# Altium schematic sheet new.SchDoc
size A2
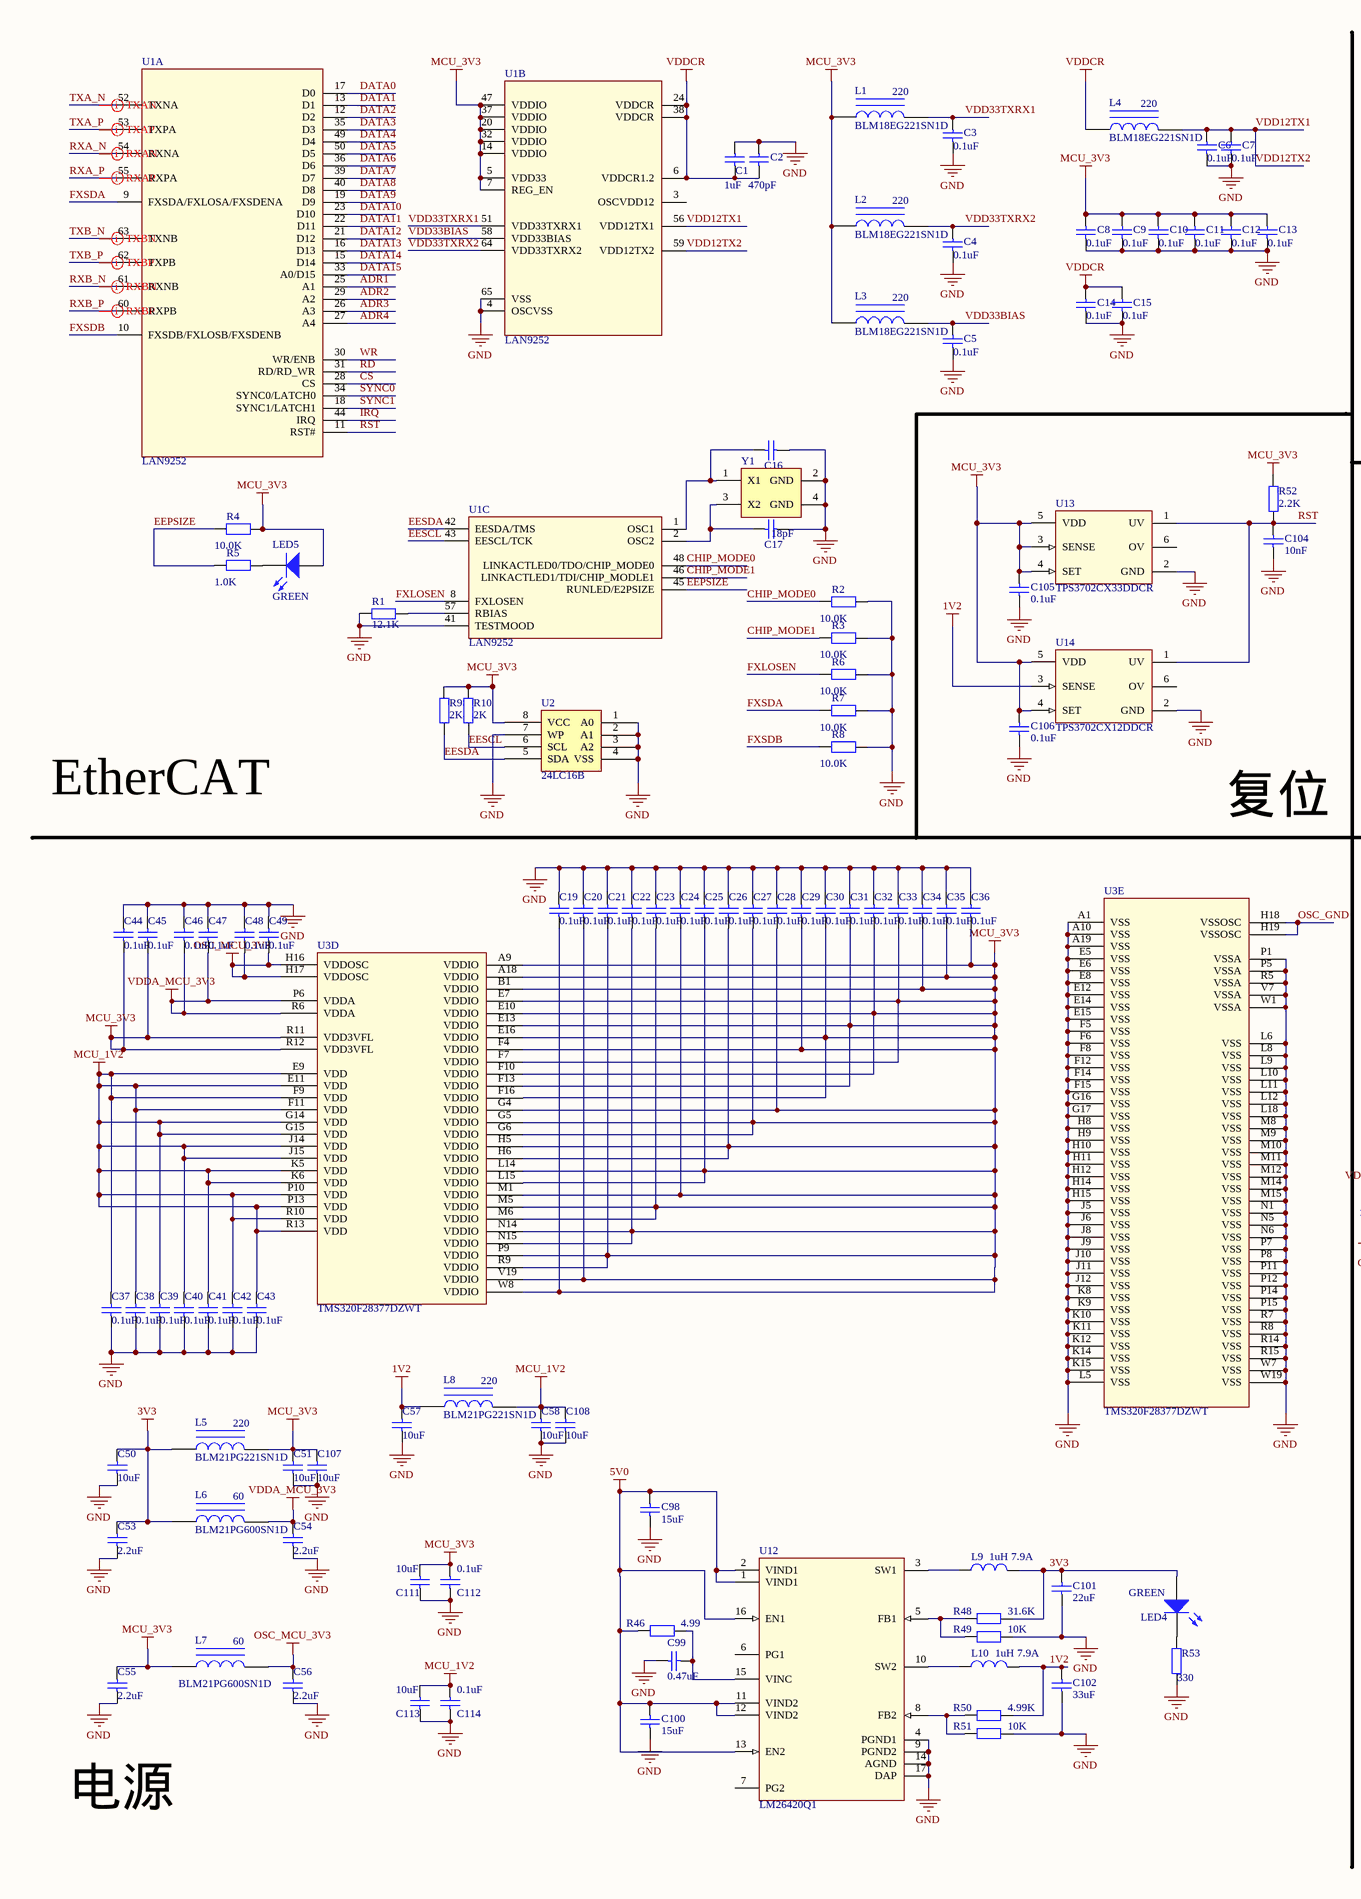
[diagram p0: new.SchDoc, left]
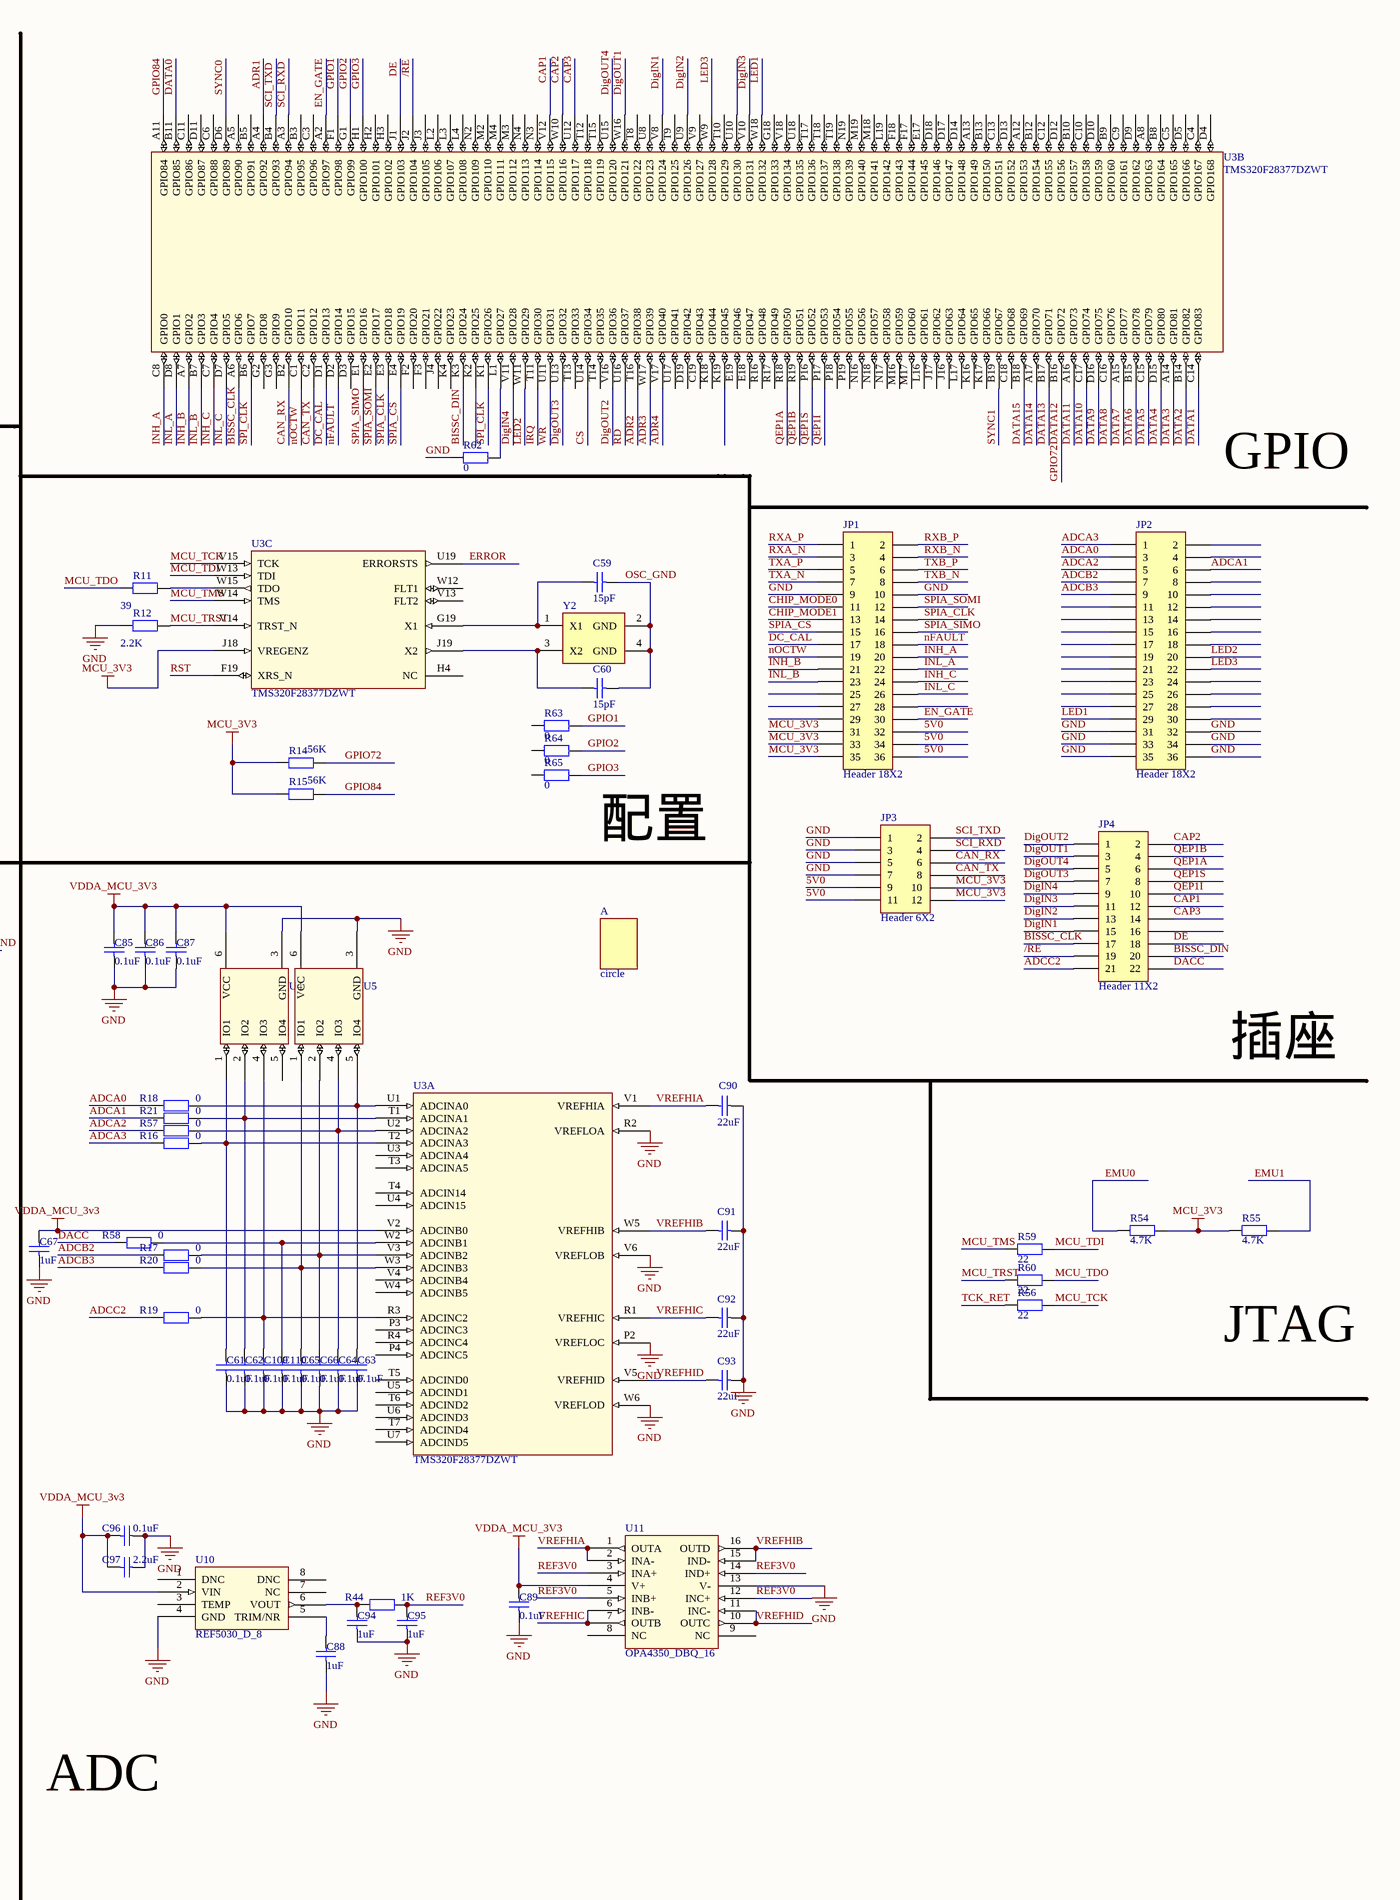
[diagram p1: new.SchDoc, right]

## Parts
A  circle  [Circle]
C1  value 1uF  [CC1608-0603]  (hidden comment: 0603B105J6R3NT)
C2  value 470pF  [CC1005-0402]  (hidden comment: 0402B471J6R3NT)
C3  value 0.1uF  [CC1005-0402]  (hidden comment: 0402B104J6R3NT)
C4  value 0.1uF  [CC1005-0402]  (hidden comment: 0402B104J6R3NT)
C5  value 0.1uF  [CC1005-0402]  (hidden comment: 0402B104J6R3NT)
C6  value 0.1uF  [CC1005-0402]  (hidden comment: 0402B104J6R3NT)
C7  value 0.1uF  [CC1005-0402]  (hidden comment: 0402B104J6R3NT)
C8  value 0.1uF  [CC1005-0402]  (hidden comment: 0402B104J6R3NT)
C9  value 0.1uF  [CC1005-0402]  (hidden comment: 0402B104J6R3NT)
C10  value 0.1uF  [CC1005-0402]  (hidden comment: 0402B104J6R3NT)
C11  value 0.1uF  [CC1005-0402]  (hidden comment: 0402B104J6R3NT)
C12  value 0.1uF  [CC1005-0402]  (hidden comment: 0402B104J6R3NT)
C13  value 0.1uF  [CC1005-0402]  (hidden comment: 0402B104J6R3NT)
C14  value 0.1uF  [CC1005-0402]  (hidden comment: 0402B104J6R3NT)
C15  value 0.1uF  [CC1005-0402]  (hidden comment: 0402B104J6R3NT)
C16  value 18pF  [CC1005-0402]  (hidden comment: 0402B180J6R3NT)
C17  Vaule: 18pF  [CC1005-0402]  (hidden comment: 0402B180J6R3NT)
C19  value 0.1uF  [CC1005-0402]  (hidden comment: 0402B104J6R3NT)
C20  value 0.1uF  [CC1005-0402]  (hidden comment: 0402B104J6R3NT)
C21  value 0.1uF  [CC1005-0402]  (hidden comment: 0402B104J6R3NT)
C22  value 0.1uF  [CC1005-0402]  (hidden comment: 0402B104J6R3NT)
C23  value 0.1uF  [CC1005-0402]  (hidden comment: 0402B104J6R3NT)
C24  value 0.1uF  [CC1005-0402]  (hidden comment: 0402B104J6R3NT)
C25  value 0.1uF  [CC1005-0402]  (hidden comment: 0402B104J6R3NT)
C26  value 0.1uF  [CC1005-0402]  (hidden comment: 0402B104J6R3NT)
C27  value 0.1uF  [CC1005-0402]  (hidden comment: 0402B104J6R3NT)
C28  value 0.1uF  [CC1005-0402]  (hidden comment: 0402B104J6R3NT)
C29  value 0.1uF  [CC1005-0402]  (hidden comment: 0402B104J6R3NT)
C30  value 0.1uF  [CC1005-0402]  (hidden comment: 0402B104J6R3NT)
C31  value 0.1uF  [CC1005-0402]  (hidden comment: 0402B104J6R3NT)
C32  value 0.1uF  [CC1005-0402]  (hidden comment: 0402B104J6R3NT)
C33  value 0.1uF  [CC1005-0402]  (hidden comment: 0402B104J6R3NT)
C34  value 0.1uF  [CC1005-0402]  (hidden comment: 0402B104J6R3NT)
C35  value 0.1uF  [CC1005-0402]  (hidden comment: 0402B104J6R3NT)
C36  value 0.1uF  [CC1005-0402]  (hidden comment: 0402B104J6R3NT)
C37  value 0.1uF  [CC1005-0402]  (hidden comment: 0402B104J6R3NT)
C38  value 0.1uF  [CC1005-0402]  (hidden comment: 0402B104J6R3NT)
C39  value 0.1uF  [CC1005-0402]  (hidden comment: 0402B104J6R3NT)
C40  value 0.1uF  [CC1005-0402]  (hidden comment: 0402B104J6R3NT)
C41  value 0.1uF  [CC1005-0402]  (hidden comment: 0402B104J6R3NT)
C42  value 0.1uF  [CC1005-0402]  (hidden comment: 0402B104J6R3NT)
C43  value 0.1uF  [CC1005-0402]  (hidden comment: 0402B104J6R3NT)
C44  value 0.1uF  [CC1005-0402]  (hidden comment: 0402B104J6R3NT)
C45  value 0.1uF  [CC1005-0402]  (hidden comment: 0402B104J6R3NT)
C46  value 0.1uF  [CC1005-0402]  (hidden comment: 0402B104J6R3NT)
C47  value 0.1uF  [CC1005-0402]  (hidden comment: 0402B104J6R3NT)
C48  value 0.1uF  [CC1005-0402]  (hidden comment: 0402B104J6R3NT)
C49  value 0.1uF  [CC1005-0402]  (hidden comment: 0402B104J6R3NT)
C50  value 10uF  [CC1608-0603]  (hidden comment: 0603B106J6R3NT)
C51  value 10uF  [CC1608-0603]  (hidden comment: 0603B106J6R3NT)
C53  value 2.2uF  [CC1608-0603]  (hidden comment: 0603B225J6R3NT)
C54  value 2.2uF  [CC1608-0603]  (hidden comment: 0603B225J6R3NT)
C55  value 2.2uF  [CC1608-0603]  (hidden comment: 0603B225J6R3NT)
C56  value 2.2uF  [CC1608-0603]  (hidden comment: 0603B225J6R3NT)
C57  value 10uF  [CC1608-0603]  (hidden comment: 0603B106J6R3NT)
C58  value 10uF  [CC1608-0603]  (hidden comment: 0603B106J6R3NT)
C59  value 15pF  [CC1005-0402]  (hidden comment: 0402B150J6R3NT)
C60  value 15pF  [CC1005-0402]  (hidden comment: 0402B150J6R3NT)
C61  value 0.1uF  [CC1005-0402]  (hidden comment: 0402B104J6R3NT)
C62  value 0.1uF  [CC1005-0402]  (hidden comment: 0402B104J6R3NT)
C63  value 0.1uF  [CC1005-0402]  (hidden comment: 0402B104J6R3NT)
C64  value 0.1uF  [CC1005-0402]  (hidden comment: 0402B104J6R3NT)
C65  value 0.1uF  [CC1005-0402]  (hidden comment: 0402B104J6R3NT)
C66  value 0.1uF  [CC1005-0402]  (hidden comment: 0402B104J6R3NT)
C67  value 1uF  [CC1005-0402]  (hidden comment: 0402B105J6R3NT)
C85  value 0.1uF  [CC1005-0402]  (hidden comment: 0402B104J6R3NT)
C86  value 0.1uF  [CC1005-0402]  (hidden comment: 0402B104J6R3NT)
C87  value 0.1uF  [CC1005-0402]  (hidden comment: 0402B104J6R3NT)
C88  value 1uF  [CC1608-0603]  (hidden comment: 0603B105J6R3NT)
C89  value 0.1uF  [CC1005-0402]  (hidden comment: 0402B104J6R3NT)
C90  value 22uF  [CC2012-0805]  (hidden comment: 0805B226J6R3NT)
C91  value 22uF  [CC2012-0805]  (hidden comment: 0805B226J6R3NT)
C92  value 22uF  [CC2012-0805]  (hidden comment: 0805B226J6R3NT)
C93  value 22uF  [CC2012-0805]  (hidden comment: 0805B226J6R3NT)
C94  value 1uF  [CC1608-0603]  (hidden comment: 0603B105J6R3NT)
C95  value 1uF  [CC1608-0603]  (hidden comment: 0603B105J6R3NT)
C96  value 0.1uF  [CC1005-0402]  (hidden comment: 0402B104J6R3NT)
C97  value 2.2uF  [CC1608-0603]  (hidden comment: 0603B225J6R3NT)
C98  value 15uF  [CC3216-1206]  (hidden comment: 1206B156J6R3NT)
C99  value 0.47uF  [CC2012-0805]  (hidden comment: 0805B474J6R3NT)
C100  value 15uF  [CC3216-1206]  (hidden comment: 1206B156J6R3NT)
C101  value 22uF  [CC3216-1206]  (hidden comment: 1206B226J6R3NT)
C102  value 33uF  [CC3225-1210]  (hidden comment: 1206B336J6R3NT)
C104  value 10nF  [CC1005-0402]  (hidden comment: 0402B103J6R3NT)
C105  value 0.1uF  [CC1005-0402]  (hidden comment: 0402B104J6R3NT)
C106  value 0.1uF  [CC1005-0402]  (hidden comment: 0402B104J6R3NT)
C107  value 10uF  [CC1608-0603]  (hidden comment: 0603B106J6R3NT)
C108  value 10uF  [CC1608-0603]  (hidden comment: 0603B106J6R3NT)
C109  value 0.1uF  [CC1005-0402]  (hidden comment: 0402B104J6R3NT)
C110  value 0.1uF  [CC1005-0402]  (hidden comment: 0402B104J6R3NT)
C111  value 10uF  [CC1608-0603]  (hidden comment: 0603B106J6R3NT)
C112  value 0.1uF  [CC1005-0402]  (hidden comment: 0402B104J6R3NT)
C113  value 10uF  [CC1608-0603]  (hidden comment: 0603B106J6R3NT)
C114  value 0.1uF  [CC1005-0402]  (hidden comment: 0402B104J6R3NT)
JP1  Header 18X2  [DC_1.27_36]
JP2  Header 18X2  [DC_1.27_36]
JP3  Header 6X2  [DC_1.27_12]
JP4  Header 11X2  [DC_1.27_22]
L1  BLM18EG221SN1D  value 220  [BLM0603]
L2  BLM18EG221SN1D  value 220  [BLM0603]
L3  BLM18EG221SN1D  value 220  [BLM0603]
L4  BLM18EG221SN1D  value 220  [BLM0603]
L5  BLM21PG221SN1D  value 220  [BLM0805]
L6  BLM21PG600SN1D  value 60  [BLM0805]
L7  BLM21PG600SN1D  value 60  [BLM0805]
L8  BLM21PG221SN1D  value 220  [BLM0805]
L9  value 1uH 7.9A  [RLF7030T]  (hidden comment: RLF7030T-1R0M6R4)
L10  value 1uH 7.9A  [RLF7030T]  (hidden comment: RLF7030T-1R0M6R4)
LED4  LED Chip  [0603D]  (value not drawn)
LED5  LED Chip  [0603D]  (value not drawn)
R1  value 12.1K  [CR1005-0402]  (hidden comment: RC02K1212JT)
R2  value 10.0K  [CR1005-0402]  (hidden comment: RC02K6103JT)
R3  value 10.0K  [CR1005-0402]  (hidden comment: RC02K6103JT)
R4  value 10.0K  [CR1005-0402]  (hidden comment: RC02K6103JT)
R5  value 1.0K  [CR1005-0402]  (hidden comment: RC02K6102JT)
R6  value 10.0K  [CR1005-0402]  (hidden comment: RC02K6103JT)
R7  value 10.0K  [CR1005-0402]  (hidden comment: RC02K6103JT)
R8  value 10.0K  [CR1005-0402]  (hidden comment: RC02K6103JT)
R9  value 2K  [CR1005-0402]  (hidden comment: RC02K202JT)
R10  value 2K  [CR1005-0402]  (hidden comment: RC02K202JT)
R11  value 39  [CR1005-0402]  (hidden comment: RC02K390JT)
R12  value 2.2K  [CR1005-0402]  (hidden comment: RC02K222JT)
R14  value 56K  [CR1005-0402]  (hidden comment: RC02K563JT)
R15  value 56K  [CR1005-0402]  (hidden comment: RC02K563JT)
R16  value 0  [CR1005-0402]  (hidden comment: RC02K000JT)
R17  value 0  [CR1005-0402]  (hidden comment: RC02K000JT)
R18  value 0  [CR1005-0402]  (hidden comment: RC02K000JT)
R19  value 0  [CR1005-0402]  (hidden comment: RC02K000JT)
R20  value 0  [CR1005-0402]  (hidden comment: RC02K000JT)
R21  value 0  [CR1005-0402]  (hidden comment: RC02K000JT)
R44  value 1K  [CR1608-0603]  (hidden comment: RC03K102JT)
R46  value 4.99  [CR1608-0603]  (hidden comment: RC03K4R99JT)
R48  value 31.6K  [CR1608-0603]  (hidden comment: RC03K3162JT)
R49  value 10K  [CR1608-0603]  (hidden comment: RC03K103JT)
R50  value 4.99K  [CR1608-0603]  (hidden comment: RC03K4991JT)
R51  value 10K  [CR1608-0603]  (hidden comment: RC03K103JT)
R52  value 2.2K  [CR1005-0402]  (hidden comment: RC02K222JT)
R53  value 330  [CR1608-0603]  (hidden comment: RC03K331JT)
R54  value 4.7K  [CR1005-0402]  (hidden comment: RC02K472JT)
R55  value 4.7K  [CR1005-0402]  (hidden comment: RC02K472JT)
R56  value 22  [CR1608-0603]  (hidden comment: RC02K220JT)
R57  value 0  [CR1005-0402]  (hidden comment: RC02K000JT)
R58  value 0  [CR1005-0402]  (hidden comment: RC02K000JT)
R59  value 22  [CR1608-0603]  (hidden comment: RC02K220JT)
R60  value 22  [CR1608-0603]  (hidden comment: RC02K220JT)
R62  value 0  [CR1005-0402]  (hidden comment: RC02K000JT)
R63  value 0  [CR1005-0402]  (hidden comment: RC02K000JT)
R64  value 0  [CR1005-0402]  (hidden comment: RC02K000JT)
R65  value 0  [CR1005-0402]  (hidden comment: RC02K000JT)
U1  LAN9252  [LAN9252]  (parts A,B,C of 3)
U2  24LC16B  [24FC512]
U3  TMS320F28377DZWT  [TMS320F28377D]  (parts A,B,C,D,E of 5)
U4  TPD4E001_DRL_6  [TPD4E001]  (value not drawn)
U5  TPD4E001_DRL_6  [TPD4E001]  (value not drawn)
U10  REF5030_D_8  [REF5030]
U11  OPA4350_DBQ_16  [OPA4350]
U12  LM26420Q1  [LM26420]
U13  TPS3702CX33DDCR  [TPS3702]
U14  TPS3702CX12DDCR  [TPS3702]
Y1  25MHz  [7B-20MHz]  (value not drawn)
Y2  XTAL1  [7B-20MHz]  (value not drawn)

## Nets
1V2: C57.1 C102.1 L8.1 L10.2 R50.2 U14.3(SENSE)
3V3: C50.1 C53.1 C101.1 L5.1 L6.1 L9.2 LED4.1(A) R48.2
5V0: C98.1 C100.1 JP1.32 JP1.34 JP1.36 JP3.9 JP3.11 R46.1 U12.1(VIND1) U12.2(VIND1) U12.11(VIND2) U12.12(VIND2) U12.13(EN2) U12.16(EN1)
GND: C1.2 C2.2 C3.1 C4.1 C5.1 C6.1 C7.1 C8.1 C9.1 C10.1 C11.1 C12.1 C13.1 C14.1 C15.1 C16.1 C17.1 C19.1 C20.1 C21.1 C22.1 C23.1 C24.1 C25.1 C26.1 C27.1 C28.1 C29.1 C30.1 C31.1 C32.1 C33.1 C34.1 C35.1 C36.1 C37.2 C38.2 C39.2 C40.2 C41.2 C42.2 C43.2 C44.1 C45.1 C46.1 C47.1 C48.1 C49.1 C50.2 C51.2 C53.2 C54.2 C55.2 C56.2 C57.2 C58.2 C61.1 C62.1 C63.1 C64.1 C65.1 C66.1 C67.1 C85.1 C86.1 C87.1 C88.1 C89.1 C90.1 C91.1 C92.1 C93.1 C94.1 C95.1 C96.1 C97.1 C98.2 C99.1 C100.2 C101.2 C102.2 C104.2 C105.2 C106.2 C107.2 C108.2 C109.1 C110.1 C111.1 C112.1 C113.1 C114.1 JP1.9 JP1.10 JP2.31 JP2.32 JP2.33 JP2.34 JP2.35 JP2.36 JP3.1 JP3.3 JP3.5 JP3.7 R1.1 R2.2 R3.2 R6.2 R7.2 R8.2 R12.1 R49.2 R51.2 R53.1 R62.1 U1.4(OSCVSS) U1.41(TESTMOOD) U1.65(VSS) U2.1(A0) U2.2(A1) U2.3(A2) U2.4(VSS) U2.7(WP) U3.A1(VSS) U3.A10(VSS) U3.A19(VSS) U3.E5(VSS) U3.E6(VSS) U3.E8(VSS) U3.E12(VSS) U3.E14(VSS) U3.E15(VSS) U3.F5(VSS) U3.F6(VSS) U3.F8(VSS) U3.F12(VSS) U3.F14(VSS) U3.F15(VSS) U3.G16(VSS) U3.G17(VSS) U3.H8(VSS) U3.H9(VSS) U3.H10(VSS) U3.H11(VSS) U3.H12(VSS) U3.H14(VSS) U3.H15(VSS) U3.J5(VSS) U3.J6(VSS) U3.J8(VSS) U3.J9(VSS) U3.J10(VSS) U3.J11(VSS) U3.J12(VSS) U3.K8(VSS) U3.K9(VSS) U3.K10(VSS) U3.K11(VSS) U3.K12(VSS) U3.K14(VSS) U3.K15(VSS) U3.L5(VSS) U3.L6(VSS) U3.L8(VSS) U3.L9(VSS) U3.L10(VSS) U3.L11(VSS) U3.L12(VSS) U3.L18(VSS) U3.M8(VSS) U3.M9(VSS) U3.M10(VSS) U3.M11(VSS) U3.M12(VSS) U3.M14(VSS) U3.M15(VSS) U3.N1(VSS) U3.N5(VSS) U3.N6(VSS) U3.P1(VSSA) U3.P2(VREFLOC) U3.P5(VSSA) U3.P7(VSS) U3.P8(VSS) U3.P11(VSS) U3.P12(VSS) U3.P14(VSS) U3.P15(VSS) U3.R2(VREFLOA) U3.R5(VSSA) U3.R7(VSS) U3.R8(VSS) U3.R14(VSS) U3.R15(VSS) U3.V6(VREFLOB) U3.V7(VSSA) U3.W1(VSSA) U3.W6(VREFLOD) U3.W7(VSS) U3.W19(VSS) U4.3(GND) U5.3(GND) U10.4(GND) U11.13(V-) U12.4(PGND1) U12.9(PGND2) U12.14(AGND) U12.17(DAP) U13.2(GND) U14.2(GND) Y1.2(GND) Y1.4(GND)
MCU_1V2: C37.1 C38.1 C39.1 C40.1 C41.1 C42.1 C43.1 C58.1 C108.1 C113.2 C114.2 L8.2 U3.E9(VDD) U3.E11(VDD) U3.F9(VDD) U3.F11(VDD) U3.G14(VDD) U3.G15(VDD) U3.J14(VDD) U3.J15(VDD) U3.K5(VDD) U3.K6(VDD) U3.P10(VDD) U3.P13(VDD) U3.R10(VDD) U3.R13(VDD)
MCU_3V3: C8.2 C9.2 C10.2 C11.2 C12.2 C13.2 C19.2 C20.2 C21.2 C22.2 C23.2 C24.2 C25.2 C26.2 C27.2 C28.2 C29.2 C30.2 C31.2 C32.2 C33.2 C34.2 C35.2 C36.2 C44.2 C45.2 C51.1 C55.1 C105.1 C106.1 C107.1 C111.2 C112.2 JP1.31 JP1.33 JP1.35 JP3.10 JP3.12 L1.1 L2.1 L3.1 L5.2 L7.1 LED5.1(A) R4.2 R9.2 R10.2 R14.1 R15.1 R52.2 R54.2 R55.1 U1.5(VDD33) U1.7(REG_EN) U1.14(VDDIO) U1.20(VDDIO) U1.32(VDDIO) U1.37(VDDIO) U1.47(VDDIO) U2.8(VCC) U3.A9(VDDIO) U3.A18(VDDIO) U3.B1(VDDIO) U3.E7(VDDIO) U3.E10(VDDIO) U3.E13(VDDIO) U3.E16(VDDIO) U3.F4(VDDIO) U3.F7(VDDIO) U3.F10(VDDIO) U3.F13(VDDIO) U3.F16(VDDIO) U3.G4(VDDIO) U3.G5(VDDIO) U3.G6(VDDIO) U3.H5(VDDIO) U3.H6(VDDIO) U3.J18(VREGENZ) U3.L14(VDDIO) U3.L15(VDDIO) U3.M1(VDDIO) U3.M5(VDDIO) U3.M6(VDDIO) U3.N14(VDDIO) U3.N15(VDDIO) U3.P9(VDDIO) U3.R9(VDDIO) U3.R11(VDD3VFL) U3.R12(VDD3VFL) U3.V19(VDDIO) U3.W8(VDDIO) U13.3(SENSE) U13.4(SET) U13.5(VDD) U14.4(SET) U14.5(VDD)
OSC_MCU_3V3: C48.2 C49.2 C56.1 L7.2 U3.H16(VDDOSC) U3.H17(VDDOSC)
VDDA_MCU_3V3: C46.2 C47.2 C54.1 C67.2 C85.2 C86.2 C87.2 C89.2 C96.2 C97.2 L6.2 U3.P6(VDDA) U3.R6(VDDA) U3.V2(ADCINB0) U4.6(VCC) U5.6(VCC) U10.2(VIN) U11.4(V+)
VDDCR: C1.1 C2.1 C14.2 C15.2 L4.1 U1.6(VDDCR1.2) U1.24(VDDCR) U1.38(VDDCR)
/RE: JP4.19 U3.J2(GPIO104)
ADCA0: JP2.3 R18.1
ADCA1: JP2.6 R21.1
ADCA2: JP2.5 R57.1
ADCA3: JP2.1 R16.1
ADCB2: JP2.7 R17.1
ADCB3: JP2.9 R20.1
ADCC2: JP4.21 R19.1
ADR1: U1.25(A1) U3.A4(GPIO92)
ADR2: U1.29(A2) U3.T16(GPIO38)
ADR3: U1.26(A3) U3.W17(GPIO39)
ADR4: U1.27(A4) U3.V17(GPIO40)
BISSC_CLK: JP4.17 U3.A6(GPIO6)
BISSC_DIN: JP4.20 U3.K3(GPIO24)
CAN_RX: JP3.6 U3.B2(GPIO10)
CAN_TX: JP3.8 U3.C2(GPIO12)
CAP1: JP4.12 U3.V12(GPIO115)
CAP2: JP4.2 U3.W10(GPIO116)
CAP3: JP4.14 U3.U12(GPIO117)
CHIP_MODE0: JP1.11 R2.1 U1.48(LINKACTLED0/TDO/CHIP_MODE0)
CHIP_MODE1: JP1.13 R3.1 U1.46(LINKACTLED1/TDI/CHIP_MODLE1)
CS: U1.28(CS) U3.U14(GPIO34)
DACC: JP4.22 R58.1
DATA0: U1.17(D0) U3.B11(GPIO85)
DATA1: U1.13(D1) U3.C14(GPIO83)
DATA2: U1.12(D2) U3.B14(GPIO82)
DATA3: U1.35(D3) U3.A14(GPIO81)
DATA4: U1.49(D4) U3.D15(GPIO80)
DATA5: U1.50(D5) U3.C15(GPIO79)
DATA6: U1.36(D6) U3.B15(GPIO78)
DATA7: U1.39(D7) U3.A15(GPIO77)
DATA8: U1.40(D8) U3.C16(GPIO76)
DATA9: U1.19(D9) U3.D16(GPIO75)
DATA10: U1.23(D10) U3.C17(GPIO74)
DATA11: U1.22(D11) U3.A16(GPIO73)
DATA12: R14.2 U1.21(D12) U3.B16(GPIO72)  [also labelled GPIO72]
DATA13: U1.16(D13) U3.B17(GPIO71)
DATA14: U1.15(D14) U3.A17(GPIO70)
DATA15: U1.33(A0/D15) U3.B18(GPIO69)
DC_CAL: JP1.17 U3.D1(GPIO13)
DE: JP4.18 U3.J1(GPIO103)
DigIN1: JP4.15 U3.V8(GPIO124)
DigIN2: JP4.13 U3.U9(GPIO126)
DigIN3: JP4.11 U3.V10(GPIO131)
DigIN4: JP4.9 U3.V11(GPIO28)
DigOUT1: JP4.3 U3.W16(GPIO121)
DigOUT2: JP4.1 U3.V16(GPIO36)
DigOUT3: JP4.7 U3.U13(GPIO32)
DigOUT4: JP4.5 U3.U15(GPIO120)
EEPSIZE: R4.1 R5.1 U1.45(RUNLED/E2PSIZE)
EESCL: R10.1 U1.43(EESCL/TCK) U2.6(SCL)
EESDA: R9.1 U1.42(EESDA/TMS) U2.5(SDA)
EMU0: R54.1
EMU1: R55.2
EN_GATE: JP1.30 U3.A2(GPIO97)
ERROR: U3.U19(ERRORSTS)
FXLOSEN: R6.1 U1.8(FXLOSEN)
FXSDA: R7.1 U1.9(FXSDA/FXLOSA/FXSDENA)
FXSDB: R8.1 U1.10(FXSDB/FXLOSB/FXSDENB)
GPIO1: R63.2 U3.F1(GPIO98)
GPIO2: R64.2 U3.G1(GPIO99)
GPIO3: R65.2 U3.H1(GPIO100)
GPIO84: R15.2 U3.A11(GPIO84)
INH_A: JP1.20 U3.C8(GPIO0)
INH_B: JP1.21 U3.A7(GPIO2)
INH_C: JP1.24 U3.C7(GPIO4)
INL_A: JP1.22 U3.D8(GPIO1)
INL_B: JP1.23 U3.B7(GPIO3)
INL_C: JP1.26 U3.D7(GPIO5)
IRQ: U1.44(IRQ) U3.T11(GPIO30)
LED1: JP2.29 U3.W18(GPIO132)
LED2: JP2.20 U3.W11(GPIO29)
LED3: JP2.22 U3.W9(GPIO128)
MCU_TCK: R56.2 U3.V15(TCK)
MCU_TDI: R59.2 U3.W13(TDI)
MCU_TDO: R11.1 R60.2
MCU_TMS: R59.1 U3.W14(TMS)
MCU_TRST: R12.2 R60.1 U3.V14(TRST_N)
nFAULT: JP1.18 U3.D2(GPIO14)
nOCTW: JP1.19 U3.C1(GPIO11)
OSC_GND: C59.2 C60.2 U3.H18(VSSOSC) U3.H19(VSSOSC) Y2.2(GND) Y2.4(GND)
QEP1A: JP4.6 U3.R18(GPIO50)
QEP1B: JP4.4 U3.R19(GPIO51)
QEP1I: JP4.10 U3.P17(GPIO53)
QEP1S: JP4.8 U3.P16(GPIO52)
RD: U1.31(RD/RD_WR) U3.U16(GPIO37)
REF3V0: C95.2 R44.2 U11.3(INA+) U11.5(INB+) U11.12(INC+) U11.14(IND+)
RST: C104.1 R52.1 U1.11(RST#) U3.F19(XRS_N) U13.1(UV) U14.1(UV)
RXA_N: JP1.3 U1.54(RXNA)
RXA_P: JP1.1 U1.55(RXPA)
RXB_N: JP1.4 U1.61(RXNB)
RXB_P: JP1.2 U1.60(RXPB)
SCI_RXD: JP3.4 U3.A3(GPIO94)
SCI_TXD: JP3.2 U3.B4(GPIO93)
SPI_CLK: U3.B6(GPIO7) U3.K1(GPIO26)
SPIA_CLK: JP1.14 U3.E3(GPIO18)
SPIA_CS: JP1.15 U3.E4(GPIO19)
SPIA_SIMO: JP1.16 U3.E1(GPIO16)
SPIA_SOMI: JP1.12 U3.E2(GPIO17)
SYNC0: U1.34(SYNC0/LATCH0) U3.D6(GPIO89)
SYNC1: U1.18(SYNC1/LATCH1) U3.B19(GPIO67)
TCK_RET: R56.1
TXA_N: JP1.7 U1.52(TXNA)
TXA_P: JP1.5 U1.53(TXPA)
TXB_N: JP1.8 U1.63(TXNB)
TXB_P: JP1.6 U1.62(TXPB)
VDD12TX1: C6.2 C7.2 L4.2 U1.56(VDD12TX1) U1.59(VDD12TX2)  [also labelled VDD12TX2]
VDD33BIAS: C5.2 L3.2 U1.58(VDD33BIAS)
VDD33TXRX1: C3.2 L1.2 U1.51(VDD33TXRX1)
VDD33TXRX2: C4.2 L2.2 U1.64(VDD33TXRX2)
VREFHIA: C90.2 U3.V1(VREFHIA) U11.1(OUTA) U11.2(INA-)
VREFHIB: C91.2 U3.W5(VREFHIB) U11.15(IND-) U11.16(OUTD)
VREFHIC: C92.2 U3.R1(VREFHIC) U11.6(INB-) U11.7(OUTB)
VREFHID: C93.2 U3.V5(VREFHID) U11.10(OUTC) U11.11(INC-)
WR: U1.30(WR/ENB) U3.U11(GPIO31)
NetC16_2: C16.2 U1.1(OSC1) Y1.1(X1)
NetC17_2: C17.2 U1.2(OSC2) Y1.3(X2)
NetC59_1: C59.1 U3.G19(X1) Y2.1(X1)
NetC60_1: C60.1 U3.J19(X2) Y2.3(X2)
NetC61_2: C61.2 R16.2 U3.T2(ADCINA3) U4.1(IO1)
NetC62_2: C62.2 R21.2 U3.T1(ADCINA1) U4.2(IO2)
NetC63_2: C63.2 R18.2 U3.U1(ADCINA0) U5.5(IO4)
NetC64_2: C64.2 R57.2 U3.U2(ADCINA2) U5.4(IO3)
NetC65_2: C65.2 R20.2 U3.W3(ADCINB3) U5.1(IO1)
NetC66_2: C66.2 R17.2 U3.V3(ADCINB2) U5.2(IO2)
NetC88_2: C88.2 U10.5(TRIM/NR)
NetC94_2: C94.2 R44.1 U10.6(VOUT)
NetC99_2: C99.2 R46.2 U12.15(VINC)
NetC109_2: C109.2 R19.2 U3.R3(ADCINC2) U4.4(IO3)
NetC110_2: C110.2 R58.2 U3.W2(ADCINB1)
NetL9_1: L9.1 U12.3(SW1)
NetL10_1: L10.1 U12.10(SW2)
NetLED4_2: LED4.2(K) R53.2
NetLED5_2: LED5.2(K) R5.2
NetR1_2: R1.2 U1.57(RBIAS)
NetR11_2: R11.2 U3.W15(TDO)
NetR48_1: R48.1 R49.1 U12.5(FB1)
NetR50_1: R50.1 R51.1 U12.8(FB2)
NetR62_2: R62.2 U3.L1(GPIO27)

Not connected (* = marked no-connect by the designer): JP1 25 27 28 29; JP2 2 4 8 10 11 12 13 14 15 16 17 18 19 21 23 24 25 26 27 28 30; JP4 16; R63 1; R64 1; R65 1; U1 3(OSCVDD12); U3 A5(GPIO90) A8(GPIO163) A12(GPIO153) A13(GPIO149) B3(GPIO95) B5(GPIO91) B8(GPIO164) B9(GPIO160) B10(GPIO157) B12(GPIO154) B13(GPIO150) C3(GPIO96) C4(GPIO167) C5(GPIO165) C6(GPIO88) C9(GPIO161) C10(GPIO158) C11(GPIO86) C12(GPIO155) C13(GPIO151) C18(GPIO68) C19(GPIO43) D3(GPIO15) D4(GPIO168) D5(GPIO166) D9(GPIO162) D10(GPIO159) D11(GPIO87) D12(GPIO156) D13(GPIO152) D14(GPIO148) D17(GPIO147) D18(GPIO146) D19(GPIO42) E17(GPIO145) E18(GPIO47) E19(GPIO46) F2(GPIO20) F3(GPIO21) F17(GPIO144) F18(GPIO143) G2(GPIO8) G3(GPIO9) G18(GPIO133) H2(GPIO101) H3(GPIO102) H4(NC) J3(GPIO105) J4(GPIO22) J16(GPIO63) J17(GPIO62) K2(GPIO25) K4(GPIO23) K16(GPIO65) K17(GPIO66) K18(GPIO44) K19(GPIO45) L2(GPIO106) L3(GPIO107) L4(GPIO108) L16(GPIO61) L17(GPIO64) L19(GPIO142) M2(GPIO110) M3(GPIO112) M4(GPIO111) M16(GPIO59) M17(GPIO60) M18(GPIO141) M19(GPIO140) N2(GPIO109) N3(GPIO114) N4(GPIO113) N16(GPIO56) N17(GPIO58) N18(GPIO57) N19(GPIO139) P3(ADCINC3) P4(ADCINC5) P18(GPIO54) P19(GPIO55) R4(ADCINC4) R16(GPIO48) R17(GPIO49) T3(ADCINA5) T4(ADCIN14) T5(ADCIND0) T6(ADCIND2) T7(ADCIND4) T8(GPIO122) T9(GPIO125) T10(GPIO129) T12(GPIO118) T13(GPIO33) T14(GPIO35) T15(GPIO119) T17(GPIO136) T18(GPIO137) T19(GPIO138) U3(ADCINA4) U4(ADCIN15) U5(ADCIND1) U6(ADCIND3) U7(ADCIND5) U8(GPIO123) U10(GPIO130) U17(GPIO41) U18(GPIO135) V4(ADCINB4) V9(GPIO127) V13(FLT2) V18(GPIO134) W4(ADCINB5) W12(FLT1); U4 5(IO4); U10 1(DNC) 3(TEMP) 7(NC) 8(DNC); U11 8(NC) 9(NC); U12 6(PG1) 7(PG2); U13 6(OV); U14 6(OV)

## Layout directives
differential pair: RXA_N, RXA_P, RXB_N, RXB_P, TXA_N, TXA_P, TXB_N, TXB_P

## Notes on the sheet
- GPIO
- EtherCAT
- 复位
- 配置
- 插座
- JTAG
- ADC
- 电源
- (in symbol LED Chip) GREEN

## Library data of the parts
C1-C17 C19-C51 C53-C67 C85-C102 C104-C114 = CAP
JP1 JP2 = Header 18X2: Header,36-Pin, Dual row; LatestRevisionDate: 17-Jul-2002; LatestRevisionNote: Re-released for DXP Platform.; Publisher: Altium Limited
JP3 = Header 6X2: Header, 6-Pin, Dual row; LatestRevisionDate: 17-Jul-2002; LatestRevisionNote: Re-released for DXP Platform.; Publisher: Altium Limited
JP4 = Header 11X2: Header, 10-Pin, Dual row; LatestRevisionDate: *; LatestRevisionNote: *; Publisher: *
L1-L8 = Inductor Iron: Magnetic-Core Inductor; Published: *; Revision: *; Publisher: *
L9 L10 = Inductor Chip: Inductor; Published: *; Revision: *; Publisher: *
LED4 LED5 = LED Chip: Typical Chip LED; Published: 8-Jun-2000; Revision: July-2002: Re-released for DXP Platform.; Publisher: Altium Limited
R1-R12 R14-R21 R44 R46 R48-R60 R62-R65 = Resistor
U3 = TMS320F28377DZWT: Imported; PartNumber: TMS320F28377DZWTS; Manufacturer: Texas Instruments; RefDes: RefDes; Type: DEV; Value: Value
U4 U5 = TPD4E001_DRL_6: Imported; Vendor: Texas Instruments; PACKAGE_DESIGNATOR: DRL; PIN_COUNT: 6; FAMILY_NAME: ESD Solution; INDUSTRY_STD_PKG_TYPE: SOT; Manufacturer_Part_Number: tpd4e001_drl_6; GENERIC_PART_NUMBER: TPD4E001; Datasheet URL: http://www.ti.com/lit/gpn/TPD4E001; Manufacturer: Texas Instruments; RefDes: RefDes; Type: DEV; Value: Value
U10 = REF5030_D_8: Imported; Manufacturer: Texas Instruments; INDUSTRY_STD_PKG_TYPE: SOIC; FAMILY_NAME: SERIES VOLTAGE REFERENCE; PIN_COUNT: 8; PACKAGE_DESIGNATOR: D; Datasheet URL: http://www.ti.com/lit/gpn/REF5030; GENERIC_PART_NUMBER: REF5030; Vendor: Texas Instruments; Manufacturer_Part_Number: ref5030_d_8; RefDes: RefDes; Type: DEV; Value: Value
U11 = OPA4350_DBQ_16: Imported; Manufacturer: Texas Instruments; INDUSTRY_STD_PKG_TYPE: SSOP/QSOP; FAMILY_NAME: LOW OFFSET VOLTAGE; PIN_COUNT: 16; PACKAGE_DESIGNATOR: DBQ; Datasheet URL: http://www.ti.com/lit/gpn/OPA4350; GENERIC_PART_NUMBER: OPA4350; Vendor: Texas Instruments; Manufacturer_Part_Number: opa4350_dbq_16; RefDes: RefDes; Type: DEV; Value: Value
U12 = LM26420Q1XSQ/NOP: Imported; PartNumber: LM26420Q1XSQ/NOPB; Manufacturer: Texas Instruments; CompType: IC; PIN_COUNT: 17; PackageReference: RUM0016A; MountType: SMT; RoHS: Y; RefDes: RefDes; Type: DEV; Value: Value
U13 U14 = TPS3702CX33DDCR: Imported; Alternate PartNumber: TPS3702CX33DDCT; Manufacturer: Texas Instruments; CompType: IC; PIN_COUNT: 6; PartNumber: TPS3702CX33DDCR; PackageReference: DDC0006A; MountType: SMT; RefDes: RefDes; Type: DEV; Value: Value
Y1 = XTAL1